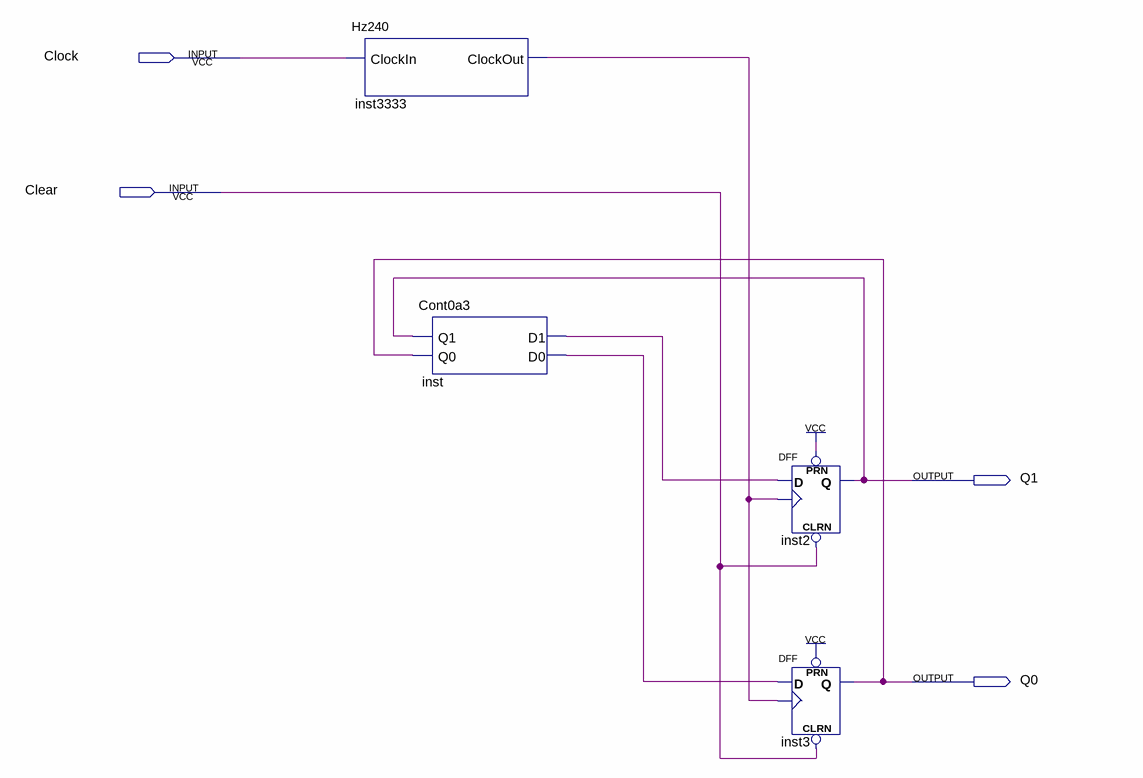
[diagram p0: schematic sheet]
// Quartus schematic Selector.bdf as structural Verilog: 4 symbols, 4 pins
module Selector (
  input  Clock,
  input  Clear,
  output Q1,
  output Q0
);

  wire inst3333_clockout, inst_d0, inst_d1;

  Hz240 inst3333 (.ClockIn(Clock), .ClockOut(inst3333_clockout));
  Cont0a3 inst (.Q1(Q1), .Q0(Q0), .D1(inst_d1), .D0(inst_d0));
  DFF inst2 (.CLRN(Clear), .CLK(inst3333_clockout), .D(inst_d1), .PRN(1'b1), .Q(Q1));
  DFF inst3 (.CLRN(Clear), .CLK(inst3333_clockout), .D(inst_d0), .PRN(1'b1), .Q(Q0));
endmodule
